# Altium project PCB_Project.PrjPcb
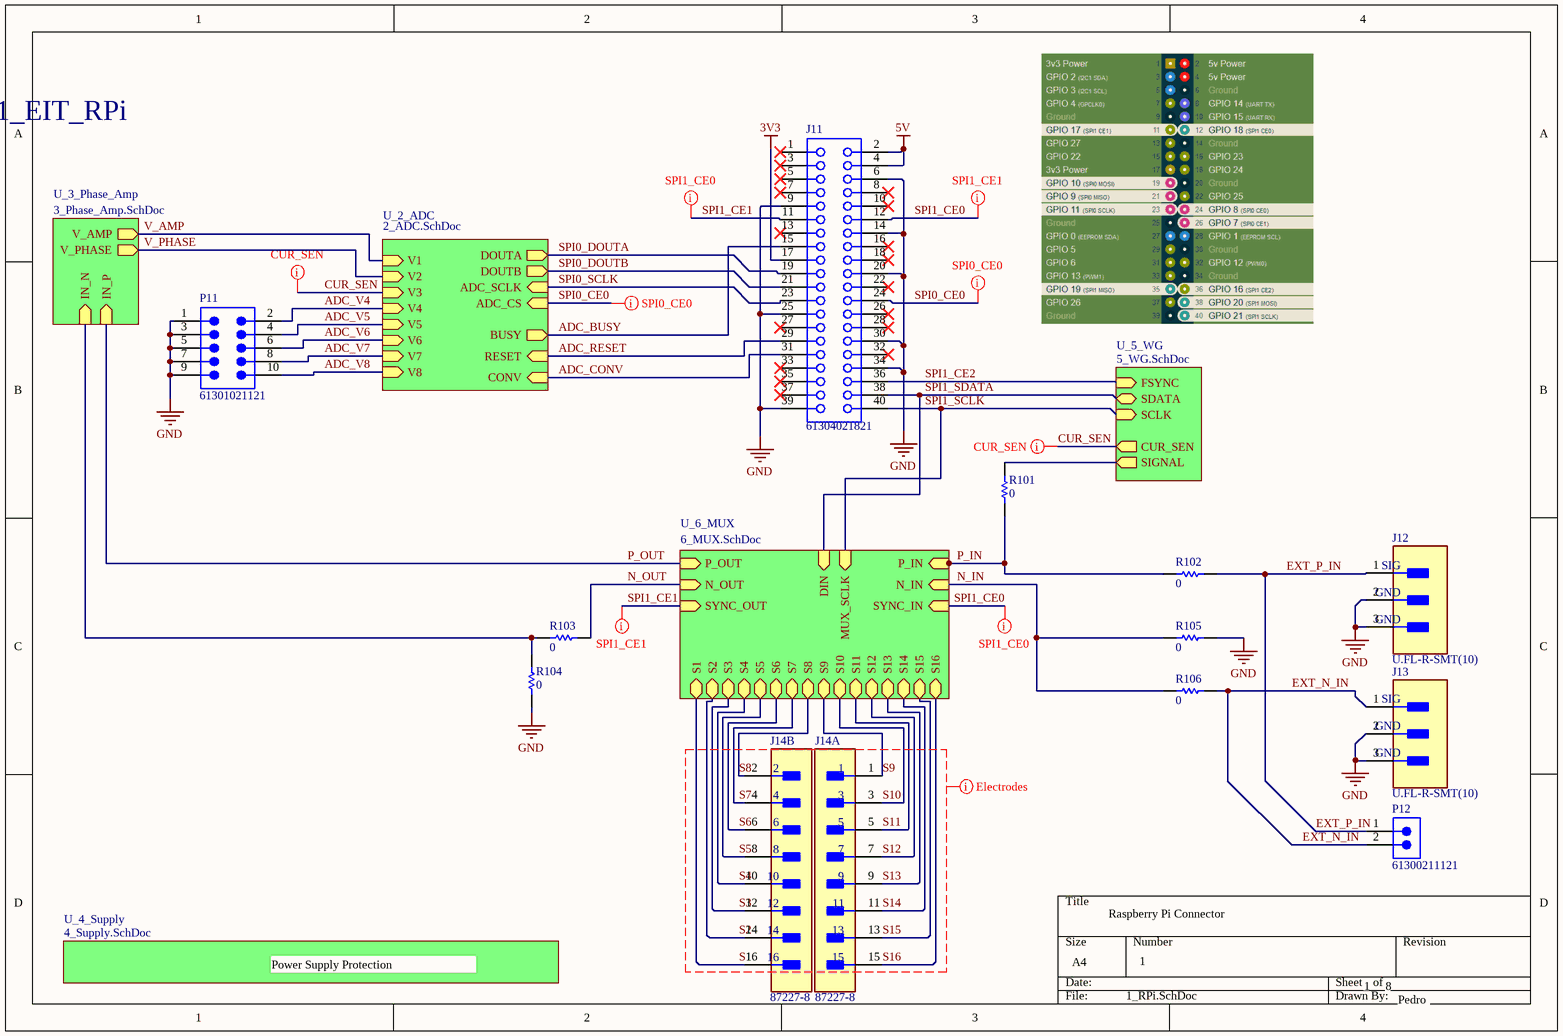
[diagram p0: 1_RPi.SchDoc]
4 sheets, 76 parts. Net scope: hierarchical (ports join the sheet entries above them; power ports are global).
Board file: 2_RPi.PcbDoc
Sheets:
  1_RPi.SchDoc
    U_2_ADC = 2_ADC.SchDoc
    U_3_Phase_Amp = 3_Phase_Amp.SchDoc
    U_5_WG = 5_WG.SchDoc

## Sheet 1_RPi.SchDoc
size A4; DocumentNumber: 1; SheetNumber: 1; SheetTotal: 8

### Parts
J11  61304021821  [61304021821]
J12  U.FL-R-SMT(10)  [FP-U_FL-R-SMT_10-MFG]
J13  U.FL-R-SMT(10)  [FP-U_FL-R-SMT_10-MFG]
J14  87227-8  [FP-87227-8-MFG]  (parts A,B of 2)
P11  61301021121  [61301021121]
P12  61300211121  [61300211121]
R101  Resistance: 0  [RESC1608X55X25LL10T15]  (hidden comment: RC0603JR-070RL)
R102  Resistance: 0  [RESC1608X55X25LL10T15]  (hidden comment: RC0603JR-070RL)
R103  Resistance: 0  [RESC1608X55X25LL10T15]  (hidden comment: RC0603JR-070RL)
R104  Resistance: 0  [RESC1608X55X25LL10T15]  (hidden comment: RC0603JR-070RL)
R105  Resistance: 0  [RESC1608X55X25LL10T15]  (hidden comment: RC0603JR-070RL)
R106  Resistance: 0  [RESC1608X55X25LL10T15]  (hidden comment: RC0603JR-070RL)

### Sub-sheets
U_2_ADC = 2_ADC.SchDoc: RESET (in), CONV (in), BUSY (out), ADC_SCLK (in), ADC_CS (in), DOUTA (out), DOUTB (out), V1 (in), V2 (in), V3 (in), V4 (in), V5 (in), V6 (in), V7 (in), V8 (in)
U_3_Phase_Amp = 3_Phase_Amp.SchDoc: V_PHASE (out), V_AMP (out), IN_P (in), IN_N (in)
U_4_Supply = 4_Supply.SchDoc (file not in this document): no entries
U_5_WG = 5_WG.SchDoc: FSYNC (in), SCLK (in), SDATA (bidir), SIGNAL (out), CUR_SEN (out)
U_6_MUX = 6_MUX.SchDoc (file not in this document): P_IN (in), SYNC_IN (in), N_IN (in), S1 (bidir), SYNC_OUT (in), MUX_SCLK (in), DIN (in), S2 (bidir), S3 (bidir), S4 (bidir), S5 (bidir), S6 (bidir), S7 (bidir), S8 (bidir), S9 (bidir), S10 (bidir), S11 (bidir), S12 (bidir), S13 (bidir), S14 (bidir), S15 (bidir), S16 (bidir), P_OUT (in), N_OUT (in)

### Nets
3V3: J11.17
5V: J11.2 J11.4
GND: J11.6 J11.9 J11.14 J11.20 J11.25 J11.30 J11.34 J11.39 J12.2(GND) J12.3(GND) J13.2(GND) J13.3(GND) P11.1 P11.3 P11.5 P11.7 P11.9 R104.2 R105.1
ADC_BUSY: J11.15 ; sheet U_2_ADC/BUSY
ADC_CONV: J11.31 ; sheet U_2_ADC/CONV
ADC_RESET: J11.29 ; sheet U_2_ADC/RESET
ADC_V4: P11.2 ; sheet U_2_ADC/V4
ADC_V5: P11.4 ; sheet U_2_ADC/V5
ADC_V6: P11.6 ; sheet U_2_ADC/V6
ADC_V7: P11.8 ; sheet U_2_ADC/V7
ADC_V8: P11.10 ; sheet U_2_ADC/V8
CUR_SEN: sheet U_2_ADC/V3, sheet U_5_WG/CUR_SEN
EXT_N_IN: J13.1(SIG) P12.2 R106.1
EXT_P_IN: J12.1(SIG) P12.1 R102.1
N_IN: R105.2 R106.2 ; sheet U_6_MUX/N_IN
N_OUT: R103.1 ; sheet U_6_MUX/N_OUT
P_IN: R101.2 R102.2 ; sheet U_6_MUX/P_IN
P_OUT: sheet U_3_Phase_Amp/IN_P, sheet U_6_MUX/P_OUT
S1: J14.16 ; sheet U_6_MUX/S1
S2: J14.14 ; sheet U_6_MUX/S2
S3: J14.12 ; sheet U_6_MUX/S3
S4: J14.10 ; sheet U_6_MUX/S4
S5: J14.8 ; sheet U_6_MUX/S5
S6: J14.6 ; sheet U_6_MUX/S6
S7: J14.4 ; sheet U_6_MUX/S7
S8: J14.2 ; sheet U_6_MUX/S8
S9: J14.1 ; sheet U_6_MUX/S9
S10: J14.3 ; sheet U_6_MUX/S10
S11: J14.5 ; sheet U_6_MUX/S11
S12: J14.7 ; sheet U_6_MUX/S12
S13: J14.9 ; sheet U_6_MUX/S13
S14: J14.11 ; sheet U_6_MUX/S14
S15: J14.13 ; sheet U_6_MUX/S15
S16: J14.15 ; sheet U_6_MUX/S16
SPI0_CE0: J11.24 ; sheet U_2_ADC/ADC_CS  [project net ADC_CS]
SPI0_DOUTA: J11.19 ; sheet U_2_ADC/DOUTA  [project net DOUTA]
SPI0_DOUTB: J11.21 ; sheet U_2_ADC/DOUTB  [project net DOUTB]
SPI0_SCLK: J11.23 ; sheet U_2_ADC/ADC_SCLK  [project net ADC_SCLK]
SPI1_CE0: J11.12 ; sheet U_6_MUX/SYNC_IN
SPI1_CE1: J11.11 ; sheet U_6_MUX/SYNC_OUT
SPI1_CE2: J11.36 ; sheet U_5_WG/FSYNC  [project net FSYNC]
SPI1_SCLK: J11.40 ; sheet U_5_WG/SCLK, sheet U_6_MUX/MUX_SCLK  [project net SCLK]
SPI1_SDATA: J11.38 ; sheet U_5_WG/SDATA, sheet U_6_MUX/DIN  [project net SDATA]
V_AMP: sheet U_2_ADC/V1, sheet U_3_Phase_Amp/V_AMP  [project net V1]
V_PHASE: sheet U_2_ADC/V2, sheet U_3_Phase_Amp/V_PHASE  [project net V2]
NetC310_2: R103.2 R104.1 ; sheet U_3_Phase_Amp/IN_N
NetIC52_5: R101.1 ; sheet U_5_WG/SIGNAL

Not connected (* = marked no-connect by the designer): J11 1* 3* 5* 7* 8* 10* 13* 16* 18* 22* 26* 27* 28* 32* 33* 35* 37*

### Layout directives
mark named SPI0_CE0: ADC_CS
mark named SPI1_CE1: SPI1_CE0, SPI1_CE1
mark named SPI1_CE0: SPI1_CE0, SPI1_CE1
mark named CUR_SEN: CUR_SEN
net class Electrodes: S1, S2, S3, S4, S5, S6, S7, S8, S9, S10, S11, S12, S13, S14, S15, S16

### Notes on the sheet
- [1] - 1_EIT_RPi
- Raspberry Pi Connector
- Power Supply Protection
- 1
- 8
- Pedro

### Library data of the parts
J11 = CMP-1502-01370-3: NexarPartId: 61924769; Gender: Female; Contact Resistance: 20mΩ; Current Rating: 3A; Operating Supply Voltage: 250V; Orientation: Vertical; Lead Pitch: 2.54mm; Number of Pins: 40; RoHS: Non-Compliant
J12 J13 = eef6fde44c591823e8076210edfe12f: CONN U.FL RCPT STR 50 OHM SMD; Plating: Silver; Connector Type: Coaxial; Frequency: 6GHz; Impedance: 50R; Body Material: Bronze; Dielectric Material: Polymer; Contact Plating: Gold; Termination: Solder; Orientation: Vertical; Contact Material: Brass; Min Operating Temperature: -40°C; Mount: Surface Mount; Lead Free: Lead Free; Max Operating Temperature: 90°C; Radiation Hardening: No; Packaging: Tape and Reel; Body Plating: Silver; Fastening Type: Snap; Max Frequency: 6GHz; Depth: 3.1mm; Package Quantity: 1; Case/Package: SMD/SMT; Housing Color: Beige; Length: 3mm
J14 = CMP-03369-000064-1: CONN HEADER VERT 16POS 2.54MM; Manufacturer: TE Connectivity; Conn Gender: Male; Conn Orientation: Straight; Current Rating: 3A; Number Of Contacts: 16; Mouser Description: Headers & Wire Housings UNSHRD VERT DUAL 16; Lead Free: Yes; Digikey Description: CONN HEADER VERT 16POS 2.54MM; Device Class L3: unset; Automotive: No; Height: 0.428inch; Temperature Range Low: -65°C; Device Class L1: Connectors; RoHS: TRUE; Pitch: 2.54mm; Package: 0; Manufacturer Part Number: 87227-8; Number Of Rows: 2; Footprint Url: https://www.te.com/commerce/DocumentDelivery/DDEController?Action=showdoc&DocId=Customer+Drawing%7F87227%7FH4%7Fpdf%7FEnglish%7FENG_CD_87227_H4.pdf%7F87227-8; ComponentLink2URL: https://www.te.com/usa-en/product-87227-8.datasheet.pdf; ComponentLink2Description: Datasheet; Temperature: -65°C to +105°C; Category: Conn; Temperature Range High: +105°C; Octopart: https://octopart.com/87227-8-te+connectivity-39407754; Device Class L2: Headers and Wire Housings; Contact Material: Gold,Nickel
P11 = Header_Male_2R_10P: NexarPartId: 18818163; Connector Type: Male Pin; Insulation Resistance: 1GΩ; Row Spacing: 2.54mm; Insulation: Insulated; Number of Positions: 10; Current Rating: 3A; Voltage Rating: 250V; Gender: Male; Contact Resistance: 20mΩ; Contact Gender: Male; Number of Rows: 2; Min Operating Temperature: -40°C; Mount: Through Hole; Packaging: Bulk; Length: 12.7mm; Pitch: 2.54mm; RoHS: Compliant; Height: 2.54mm; Lead Pitch: 2.54mm; Number of Pins: 10; Housing Material: PBT; Orientation: Vertical; Flammability Rating: UL94 V-0; Termination: Through Hole; Width: 12.7mm; Color: Black; Contact Mating Length: 5.9944mm; Max Operating Temperature: 105°C; Operating Supply Voltage: 250V; Contact Material: Copper; Number of Contacts: 10; Contact Plating: Gold; REACH SVHC: Unknown
P12 = CMP-1712-00002-6: NexarPartId: 20081794; Number of Contacts: 2; Pitch: 2.54mm; Connector Type: Male Pin; Voltage Rating: 250V; Current Rating: 3A; Gender: Male; Contact Resistance: 20mΩ; Height: 8.94mm; Lead Free: Lead Free; Number of Pins: 2; Termination: Through Hole; RoHS: Compliant; Lead Pitch: 2.54mm; REACH SVHC: No SVHC; Housing Material: PBT; Contact Mating Length: 5.9944mm; Min Operating Temperature: -40°C; Orientation: Vertical; Contact Material: Copper; Contact Gender: Male; Max Operating Temperature: 125°C; Number of Rows: 1; Number of Positions: 2; Packaging: Bulk; Contact Plating: Gold; Mount: Through Hole; Color: Black; Operating Supply Voltage: 250V
R101-R106 = RES-2: Chip Resistor, 0 Ohm, +/- 5%, 0.1 W, -55 to 155 degC, 0603 (1608 Metric), RoHS, Tape and Reel; Manufacturer: Yageo; Temperature Coefficient: 200ppm/degreesC; Voltage Rating: 50V; Power Rating: 100mW; Width: 0.8mm; Max Operating Temperature: 155degC; Tolerance: 5%; Package Reference: 0603; Height: 0.45mm; Depth: 0.8mm; Package Description: 2-Pin Surface Mount Device, Body 1.6 x 0.8 mm; Termination: SMD/SMT; Package Quantity: 5000; Case/Package: 0603; Case Code (Imperial): 0603; Radiation Hardening: No; Number of Pins: 2; Length: 1.6mm; Lead Free: LeadFree; Voltage Rating (DC): 50V; Military Standard: Not; Datasheet URL: http://www.yageo.com/NewPortal/yageodocoutput?fileName=/pdf/R-Chip/PYu-RC_Group_51_RoHS_L_5.pdf; Manufacturer URL: http://www.yageo.com/; Packaging: TapeandReel; Case Code (Metric): 1608; Min Operating Temperature: -55degC; Composition: ThickFilm; RoHSCompliant: true; Contact Plating: Tin; Datasheet Version: Rev. 5, 10/2016; REACH SVHC: NoSVHC

## Sheet 2_ADC.SchDoc
size A4; SheetNumber: 2; SheetTotal: 8
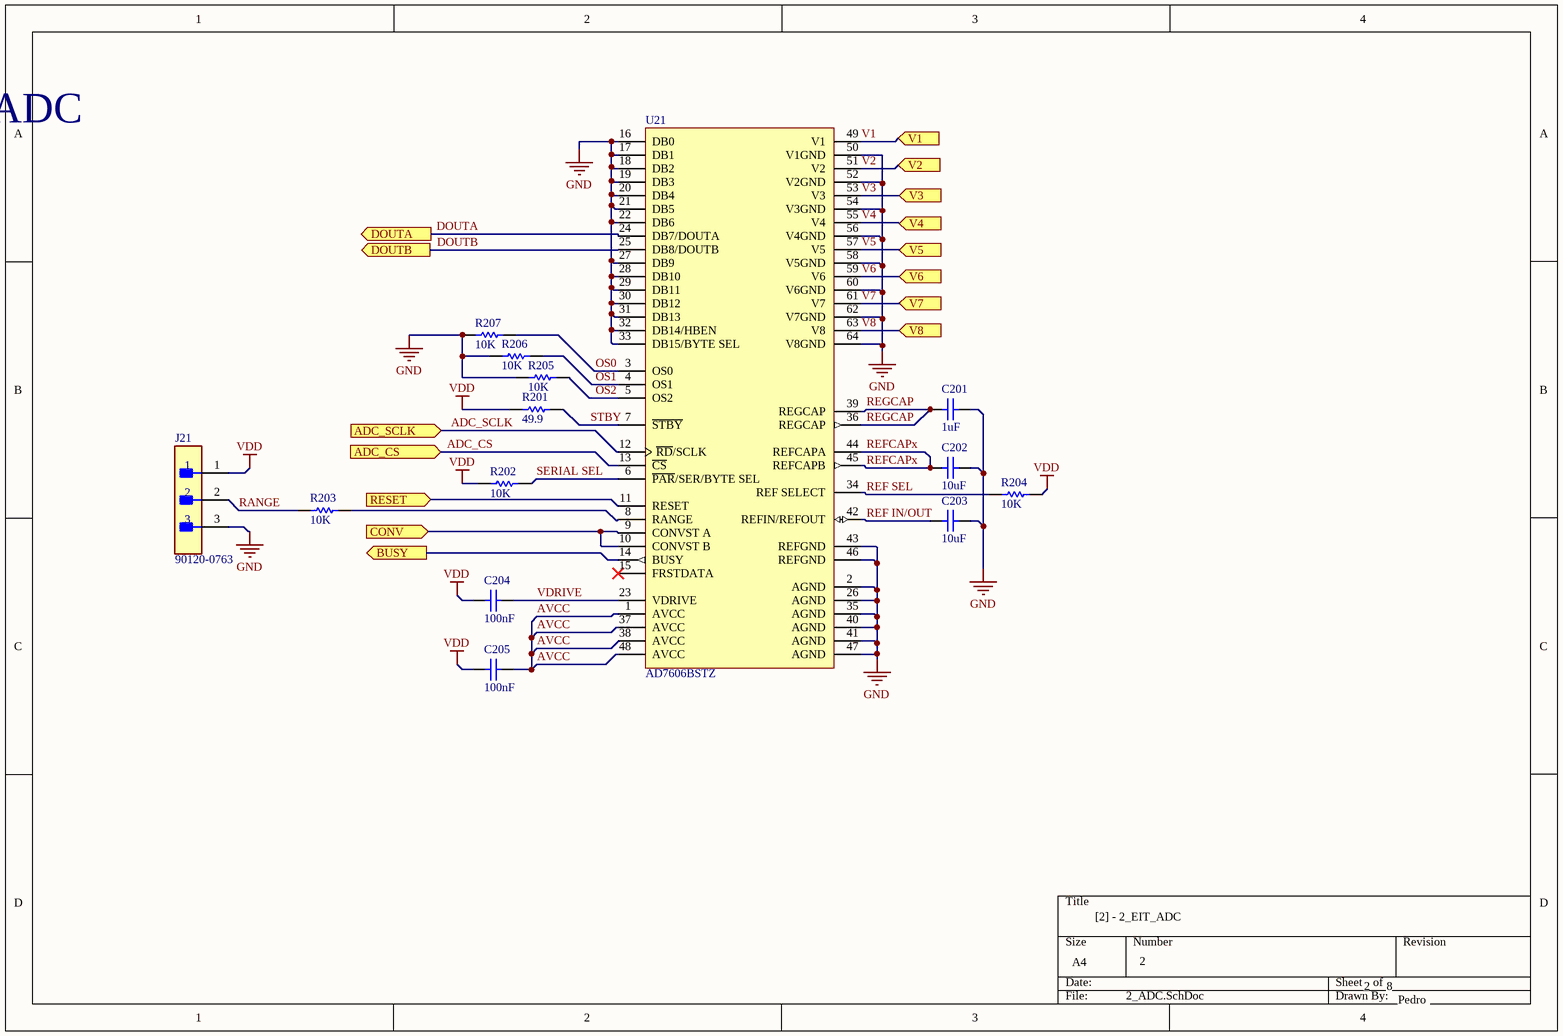
[diagram p1: 2_ADC.SchDoc]

### Parts
C201  value 1uF  [CAPC1005X55X30LL05T10]  (hidden comment: generic)
C202  value 10uF  [CAPC1005X55X30LL05T10]  (hidden comment: generic)
C203  value 10uF  [CAPC1005X55X30LL05T10]  (hidden comment: generic)
C204  value 100nF  [CAPC1005X55X30LL05T10]  (hidden comment: generic)
C205  value 100nF  [CAPC1005X55X30LL05T10]  (hidden comment: generic)
J21  90120-0763  [FP-90120-0763-MFG]
R201  Resistance: 49.9  [RESC1608X55X25LL10T15]  (hidden comment: RC0603JR-070RL)
R202  Resistance: 10K  [RESC1608X55X25LL10T15]  (hidden comment: RC0603JR-070RL)
R203  Resistance: 10K  [RESC1608X55X25LL10T15]  (hidden comment: RC0603JR-070RL)
R204  Resistance: 10K  [RESC1608X55X25LL10T15]  (hidden comment: RC0603JR-070RL)
R205  Resistance: 10K  [RESC1608X55X25LL10T15]  (hidden comment: RC0603JR-070RL)
R206  Resistance: 10K  [RESC1608X55X25LL10T15]  (hidden comment: RC0603JR-070RL)
R207  Resistance: 10K  [RESC1608X55X25LL10T15]  (hidden comment: RC0603JR-070RL)
U21  AD7606BSTZ  [ST-64-2_L]

### Ports
ADC_CS (in, see 1_RPi[2B]), ADC_SCLK (in, see 1_RPi[2B]), BUSY (out, see 1_RPi[2B]), CONV (in, see 1_RPi[2B]), DOUTA (out, see 1_RPi[2A]), DOUTB (out, see 1_RPi[2B]), RESET (in, see 1_RPi[2B]), V1 (in, see 1_RPi[1A]), V2 (in, see 1_RPi[1B]), V3 (in, see 1_RPi[1B]), V4 (in, see 1_RPi[1B]), V5 (in, see 1_RPi[1B]), V6 (in, see 1_RPi[1B]), V7 (in, see 1_RPi[1B]), V8 (in, see 1_RPi[1B])

### Nets
GND: C201.1 C202.1 C203.1 J21.3 R205.2 R206.2 R207.2 U21.2(AGND) U21.16(DB0) U21.17(DB1) U21.18(DB2) U21.19(DB3) U21.20(DB4) U21.21(DB5) U21.22(DB6) U21.26(AGND) U21.27(DB9) U21.28(DB10) U21.29(DB11) U21.30(DB12) U21.31(DB13) U21.32(DB14/HBEN) U21.33(DB15/BYTE_SEL) U21.35(AGND) U21.40(AGND) U21.41(AGND) U21.43(REFGND) U21.46(REFGND) U21.47(AGND) U21.50(V1GND) U21.52(V2GND) U21.54(V3GND) U21.56(V4GND) U21.58(V5GND) U21.60(V6GND) U21.62(V7GND) U21.64(V8GND)
VDD: C204.2 C205.2 J21.1 R201.2 R202.2 R204.1
ADC_BUSY: U21.14(BUSY) ; port BUSY
ADC_CONV: U21.9(CONVST_A) U21.10(CONVST_B) ; port CONV
ADC_CS: U21.13(~{CS}) ; port ADC_CS
ADC_RESET: U21.11(RESET) ; port RESET
ADC_SCLK: U21.12(~{RD}/SCLK) ; port ADC_SCLK
AVCC: C205.1 U21.1(AVCC) U21.37(AVCC) U21.38(AVCC) U21.48(AVCC)
DOUTA: U21.24(DB7/DOUTA) ; port DOUTA
DOUTB: U21.25(DB8/DOUTB) ; port DOUTB
OS0: R207.1 U21.3(OS0)
OS1: R206.1 U21.4(OS1)
OS2: R205.1 U21.5(OS2)
RANGE: J21.2 R203.2
REF IN/OUT: C203.2 U21.42(REFIN/REFOUT)
REF SEL: R204.2 U21.34(REF_SELECT)
REFCAPx: C202.2 U21.44(REFCAPA) U21.45(REFCAPB)
REGCAP: C201.2 U21.36(REGCAP) U21.39(REGCAP)
SERIAL SEL: R202.1 U21.6(~{PAR}/SER/BYTE_SEL)
STBY: R201.1 U21.7(~{STBY})
V1: U21.49(V1) ; port V1
V2: U21.51(V2) ; port V2
V3: U21.53(V3) ; port V3  [project net CUR_SEN]
V4: U21.55(V4) ; port V4  [project net ADC_V4]
V5: U21.57(V5) ; port V5  [project net ADC_V5]
V6: U21.59(V6) ; port V6  [project net ADC_V6]
V7: U21.61(V7) ; port V7  [project net ADC_V7]
V8: U21.63(V8) ; port V8  [project net ADC_V8]
VDRIVE: C204.1 U21.23(VDRIVE)
NetR203_1: R203.1 U21.8(RANGE)

Not connected (* = marked no-connect by the designer): U21 15(FRSTDATA)*

### Notes on the sheet
- [2] - 2_EIT_ADC
- 2
- 8
- Pedro

### Library data of the parts
C201-C205 = Capacitor: Device Class L1: Passive Components; Device Class L2: Capacitors
J21 = CMP-04776-000084-1: CONN HEADER VERT 3POS 2.54MM; Manufacturer: Molex; Voltage Rating: 350V; Number Of Contacts: 3; Conn Orientation: Vertical; Current Rating: 3A; Conn Gender: Male; Package: 90120-0763; ComponentLink2Description: Datasheet; Height: 5.8mm; Manufacturer Part Number: 90120-0763; Temperature Range High: +125°C; RoHS: TRUE; ComponentLink2URL: https://www.molex.com/webdocs/datasheets/pdf/en-us/0901200763_PCB_HEADERS.pdf; Device Class L2: Headers and Wire Housings; Temperature: -55°C to +125°C; Device Class L1: Connectors; Pitch: 2.54mm; Footprint Url: https://www.molex.com/pdm_docs/sd/901200763_sd.pdf; Device Class L3: unset; Temperature Range Low: -55°C; Number Of Rows: 1; Category: Conn; Lead Free: Yes; Mouser Description: Board-To-Board Connector, C-Grid III 90120 Series, Through Hole, Header, 3, 2.54 mm; Octopart: https://octopart.com/90120-0763-molex-655433; Contact Material: Gold,Nickel; Automotive: No; Digikey Description: CONN HEADER VERT 3POS 2.54MM
R201-R207 = RES-2: as R101 on sheet 1_RPi; Width: 0.8mm; Max Operating Temperature: 155degC; Tolerance: 5%; Package Reference: 0603; Height: 0.45mm; Depth: 0.8mm; Package Description: 2-Pin Surface Mount Device, Body 1.6 x 0.8 mm; Termination: SMD/SMT; Package Quantity: 5000; Case/Package: 0603; Case Code (Imperial): 0603; Radiation Hardening: No; Number of Pins: 2; Length: 1.6mm; Lead Free: LeadFree; Voltage Rating (DC): 50V; Military Standard: Not; Datasheet URL: http://www.yageo.com/NewPortal/yageodocoutput?fileName=/pdf/R-Chip/PYu-RC_Group_51_RoHS_L_5.pdf; Manufacturer URL: http://www.yageo.com/; Packaging: TapeandReel; Case Code (Metric): 1608; Min Operating Temperature: -55degC; Composition: ThickFilm; RoHSCompliant: true; Contact Plating: Tin; Datasheet Version: Rev. 5, 10/2016; REACH SVHC: NoSVHC
U21 = CMP-0313-00724-2: 8 Channel Data Acquisition System with 16-Bit, Bipolar Input, Simultaneous Sampling Analog-to-Digital Converter with Parallel, Serial and SPI Interface, 200KSPS, -40 to +85 degC, ST-64-2, Pb-Free, Tray; Generic Part Number: AD7606; Manufacturer: Analog Devices; Throughput Rate (SPS): 200K; Resolution (Bits): 16; Channels: 8; Interface: Par, Ser, SPI; ComponentLink2Description: Datasheet; ComponentLink1URL: http://www.analog.com/en/index.html; ComponentLink4URL: http://www.analog.com/en/analog-to-digital-converters/ad-converters/ad7606/products/product.html; DatasheetVersion: Rev.C; RoHS: Y; Code_JEDEC: MS-026-BCD; PartNumber: AD7606BSTZ; PackageVersion: 051706-A; Mounting Technology: Surface Mount; ComponentLink3URL: http://www.analog.com/static/imported-files/packages/PKG_PDF/LQFP%28ST%29/ST_64_2.pdf; PackageDescription: 64-Lead Low Profile Quad Flat Package [LQFP]; Packing: Tray; PackageReference: ST-64-2; ComponentLink1Description: Manufacturer URL; ComponentLink4Description: Product URL; ComponentLink2URL: http://www.analog.com/static/imported-files/data_sheets/AD7606_7606-6_7606-4.pdf; ComponentLink3Description: Package Specification; Supplier: Mouser; Supplier Part Number: 584-AD7606BSTZ; Manufacturer Part Number: AD7606BSTZ; Category: Analog to Digital Converters (ADCs); Stock: 2011; Pricing: 1=39,63, 10=37, 50=32,25, 100=31,46, 1000=31,46, 10000=31,46 (USD); ComponentLink5URL: https://datasheet.ciiva.com/1143/1595896-1143555.pdf?src-supplier=Element14; ComponentLink5Description: https://datasheet.ciiva.com/1143/1595896-1143555.pdf?src-supplier=Element14; ComponentLink6URL: https://datasheet.ciiva.com/3037/ad7606-7606-6-7606-4-3037717.pdf?src-supplier=Avnet; ComponentLink6Description: https://datasheet.ciiva.com/3037/ad7606-7606-6-7606-4-3037717.pdf?src-supplier=Avnet

## Sheet 3_Phase_Amp.SchDoc
size A4; DocumentNumber: 2; SheetNumber: 3; SheetTotal: 8
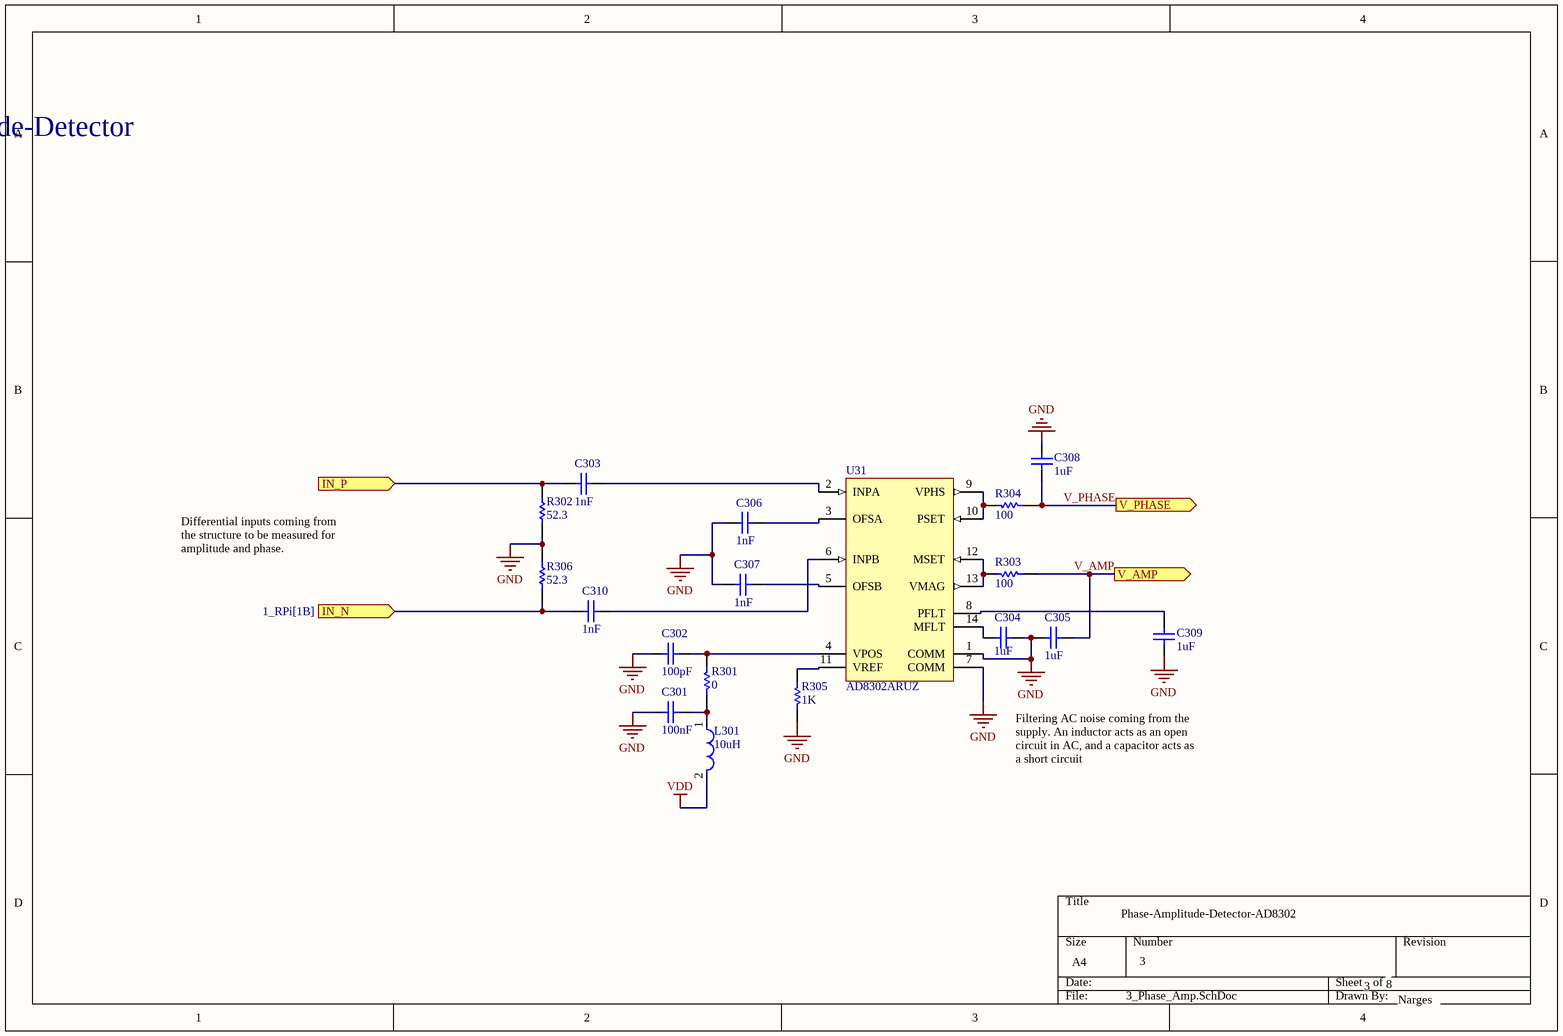
[diagram p2: 3_Phase_Amp.SchDoc]

### Parts
C301  value 100nF  [CAPC1005X55X30LL05T10]  (hidden comment: generic)
C302  value 100pF  [CAPC1005X55X30LL05T10]  (hidden comment: generic)
C303  value 1nF  [CAPC1005X55X30LL05T10]  (hidden comment: generic)
C304  value 1uF  [CAPC1005X55X30LL05T10]  (hidden comment: generic)
C305  value 1uF  [CAPC1005X55X30LL05T10]  (hidden comment: generic)
C306  value 1nF  [CAPC1005X55X30LL05T10]  (hidden comment: generic)
C307  value 1nF  [CAPC1005X55X30LL05T10]  (hidden comment: generic)
C308  value 1uF  [CAPC1005X55X30LL05T10]  (hidden comment: generic)
C309  value 1uF  [CAPC1005X55X30LL05T10]  (hidden comment: generic)
C310  value 1nF  [CAPC1005X55X30LL05T10]  (hidden comment: generic)
L301  Inductance: 10uH  [IND_0402HL-821XJRU]  (hidden comment: LQW18AN10NG00D)
R301  0  [RESC1005X40X25LL10T10]
R302  52.3  [RESC1005X40X25LL10T10]
R303  100  [RESC1005X40X25LL10T10]
R304  100  [RESC1005X40X25LL10T10]
R305  1K  [RESC1005X40X25LL10T10]
R306  52.3  [RESC1005X40X25LL10T10]
U31  AD8302ARUZ  [ADI-RU-14_L]

### Ports
IN_N (in, see 1_RPi[1B]), IN_P (in, see 1_RPi[1B]), V_AMP (out, see 1_RPi[1A]), V_PHASE (out, see 1_RPi[1A])

### Nets
GND: C301.1 C302.1 C304.1 C305.1 C306.2 C307.2 C308.1 C309.1 R302.1 R305.1 R306.2 U31.1(COMM) U31.7(COMM)
VDD: L301.2
P_OUT: C303.1 R302.2 ; port IN_P
V_AMP: C305.2 R303.2 ; port V_AMP  [project net V1]
V_PHASE: C308.2 R304.2 ; port V_PHASE  [project net V2]
NetC301_2: C301.2 L301.1 R301.2
NetC302_2: C302.2 R301.1 U31.4(VPOS)
NetC303_2: C303.2 U31.2(INPA)
NetC304_2: C304.2 U31.14(MFLT)
NetC306_1: C306.1 U31.3(OFSA)
NetC307_1: C307.1 U31.5(OFSB)
NetC309_2: C309.2 U31.8(PFLT)
NetC310_1: C310.1 U31.6(INPB)
NetC310_2: C310.2 R306.1 ; port IN_N
NetR303_1: R303.1 U31.12(MSET) U31.13(VMAG)
NetR304_1: R304.1 U31.9(VPHS) U31.10(PSET)
NetR305_2: R305.2 U31.11(VREF)

### Notes on the sheet
- [3] - 3_EIT_Phase-Amplitude-Detector
- Differential inputs coming from the structure to be measured for amplitude and phase.
- Filtering AC noise coming from the supply. An inductor acts as an open circuit in AC, and a capacitor acts as a short circuit
- Phase-Amplitude-Detector-AD8302
- 3
- 8
- Narges

### Library data of the parts
C301-C310 = Capacitor: Device Class L1: Passive Components; Device Class L2: Capacitors
L301 = 725321dda6339637d4d059423bc1c3c: Wire Wound RF Inductor 10nH ±2% 650mA 0.11Ω 0603 (1608); DC Resistance (DCR): 110mR; Q Factor: 35; Shielding: Unshielded; Test Frequency: 100MHz; Current: 550mA; Self Resonant Frequency: 6GHz; Radiation Hardening: No; Depth: 1mm; Case Code (Imperial): 0603; Inductance Tolerance: 2%; Series: LQW18A_00; Tolerance: 2%; Weight: 0.000106oz; Rated Current-Max: 650mA; Mount: Surface Mount; Series Resistance: 110mR; REACH SVHC: No SVHC; Current Rating: 650mA; Case Code (Metric): 1608; Lead Free: Lead Free; Resistor Type: Wirewound; Package Quantity: 4000; Termination: SMD/SMT; DC Current: 650mA; Height: 0.8mm; Min Operating Temperature: -55°C; Military Standard: Not; Max Operating Temperature: 125°C; Max DC Current: 650mA; Case/Package: 0603; Number of Pins: 2; Packaging: Tape and Reel; Width: 0.8mm; Length: 1.6mm
R301-R306 = Resistor: generic; Part Number: RC0402FR-0747KL; Manufacturer: Yageo / Phycomp
U31 = CMP-0284-00076-1: LF-2.7 GHz RF/IF Gain and Phase Detector, 60ns Response Time, RU-14, Pb-Free, 96 Tube; Voltage Supply (V): 2.7 to 5.5; RF Frequency (MHz): 2700; Dynamic Range (dB): 60dB; Supply Current: 19mA; Temp Stability (dB): 1dB; Product Description: Dual-Channel Gain and Phase Outputs; ComponentLink1URL: www.analog.com; Response Time (ns typ): 60ns; ComponentLink1Description: Manufacturer URL; Code_JEDEC: MO-153AB-1; ComponentLink3URL: http://www.analog.com/static/imported-files/packages/36057385283879153717235186773RU14.pdf; PackageReference: RU-14; PackageVersion: Aug-2002; DatasheetVersion: Rev. A; ComponentLink2URL: http://www.analog.com/static/imported-files/data_sheets/AD8302.pdf; ComponentLink3Description: Package Specification; PackageDescription: 14-Lead Thin Shrink Small Outline Package [TSSOP]; ComponentLink2Description: Datasheet

## Sheet 5_WG.SchDoc
size A3; DocumentNumber: 4; SheetNumber: 5; SheetTotal: 8
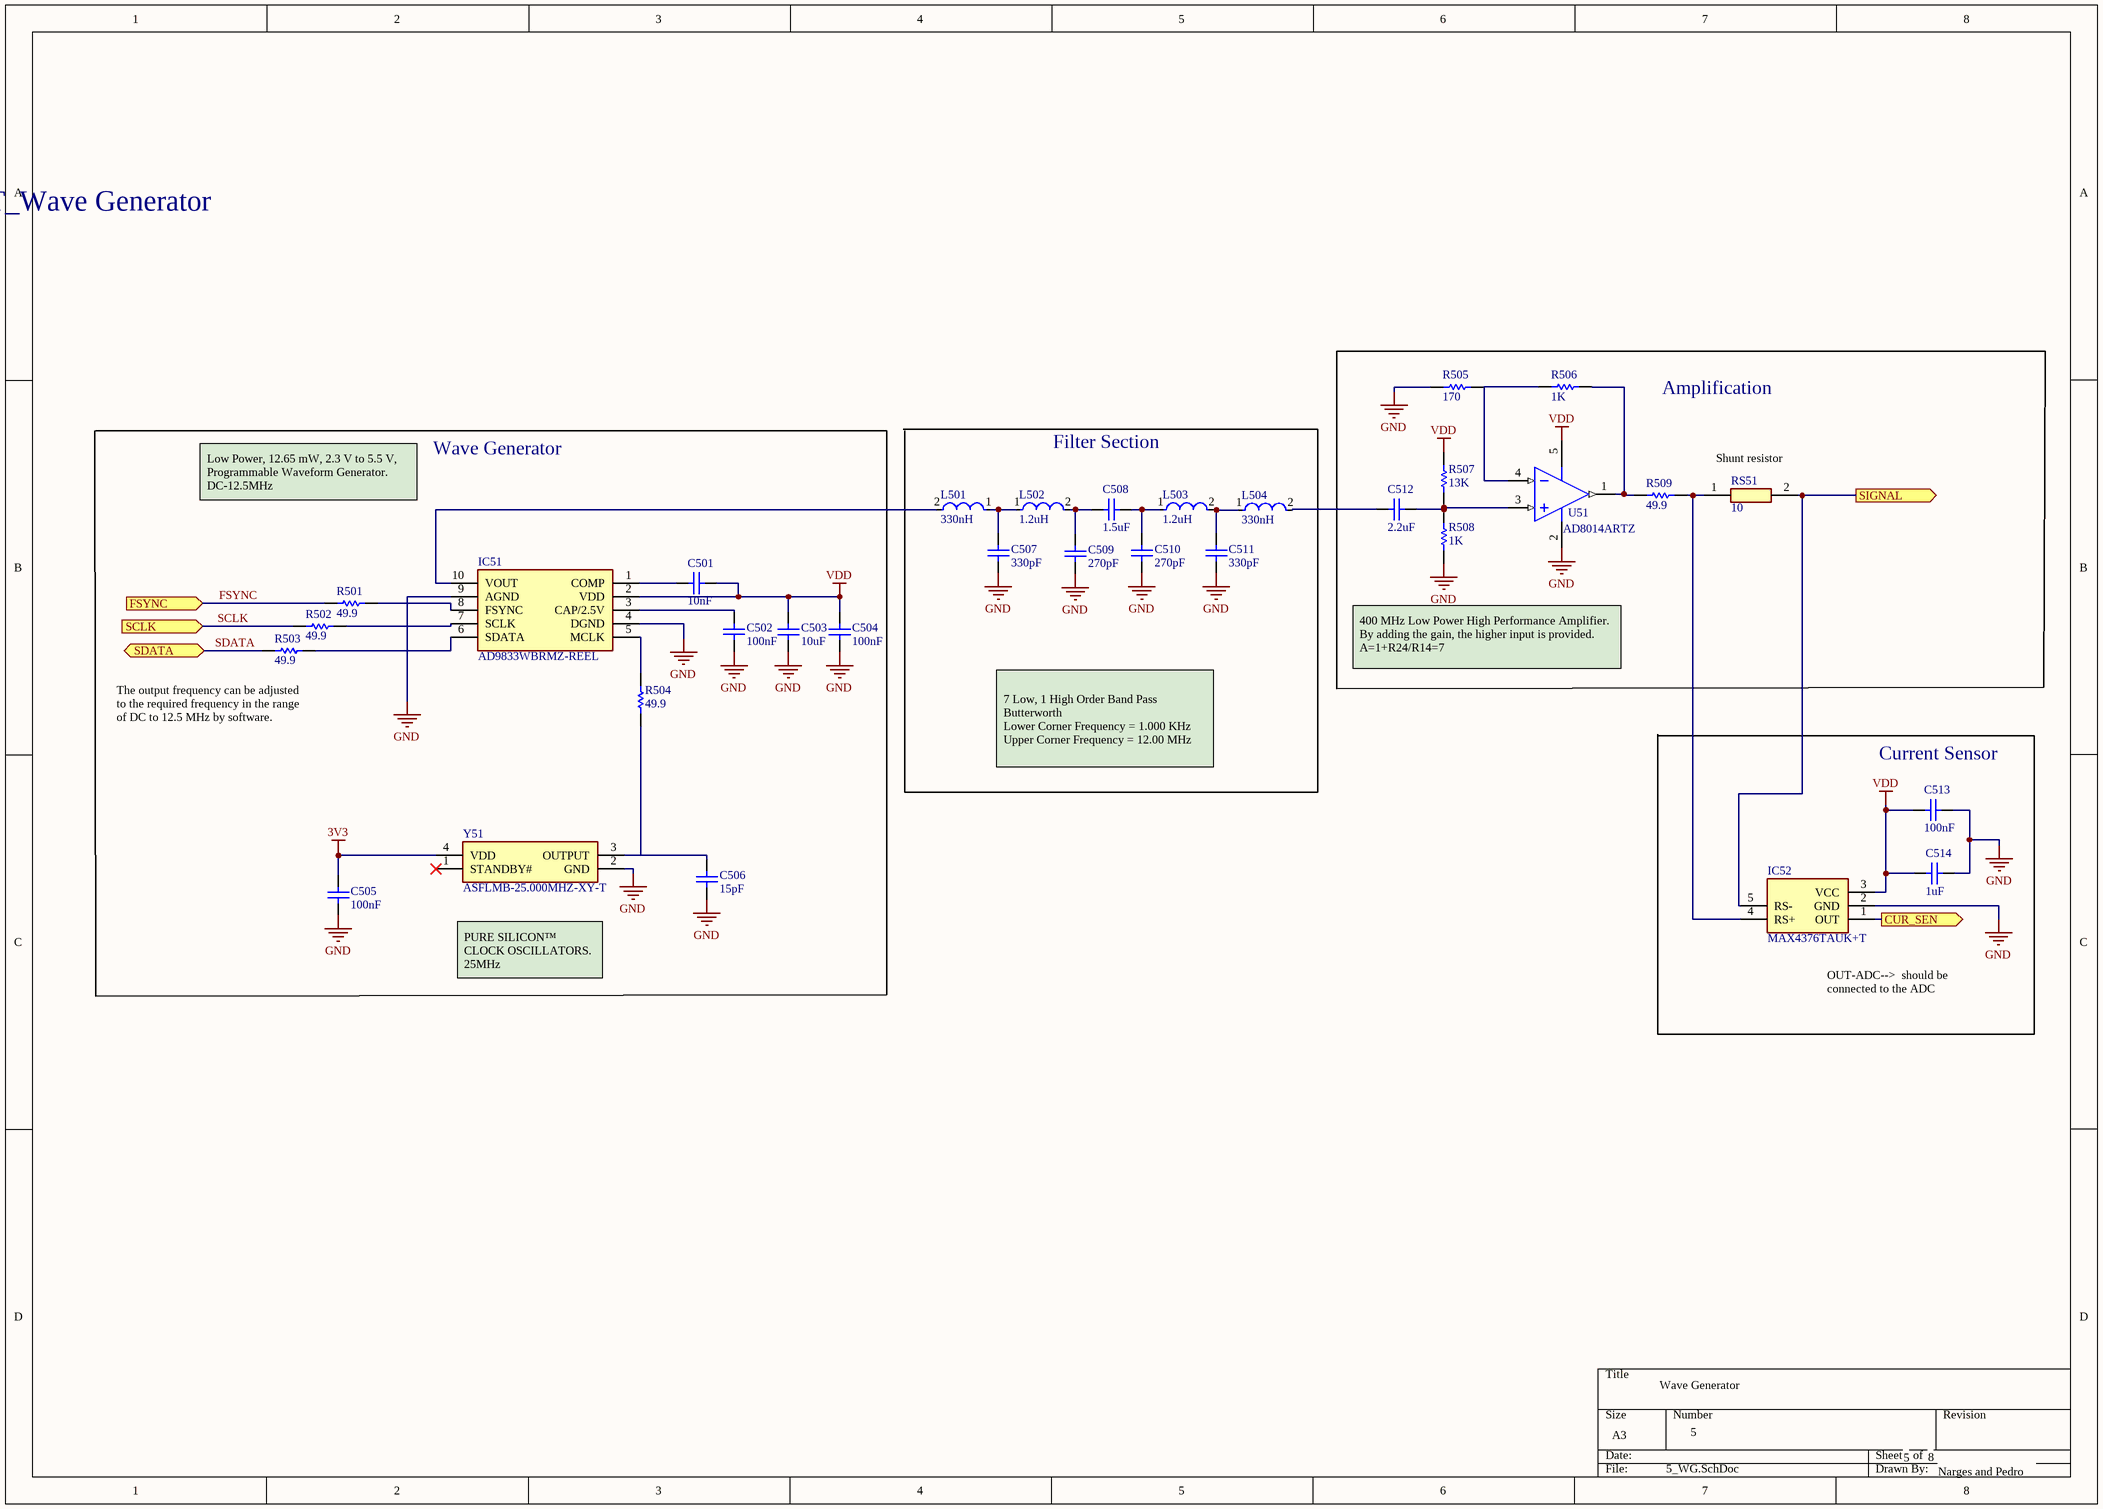
[diagram p3: 5_WG.SchDoc]

### Parts
C501  value 10nF  [CAPC1005X55X30LL05T10]  (hidden comment: generic)
C502  value 100nF  [CAPC1005X55X30LL05T10]  (hidden comment: generic)
C503  value 10uF  [CAPC1005X55X30LL05T10]  (hidden comment: generic)
C504  value 100nF  [CAPC1005X55X30LL05T10]  (hidden comment: generic)
C505  value 100nF  [CAPC1005X55X30LL05T10]  (hidden comment: generic)
C506  value 15pF  [CAPC1005X55X30LL05T10]  (hidden comment: generic)
C507  value 330pF  [CAPC1005X55X30LL05T10]  (hidden comment: generic)
C508  value 1.5uF  [CAPC1005X55X30LL05T10]  (hidden comment: generic)
C509  value 270pF  [CAPC1005X55X30LL05T10]  (hidden comment: generic)
C510  value 270pF  [CAPC1005X55X30LL05T10]  (hidden comment: generic)
C511  value 330pF  [CAPC1005X55X30LL05T10]  (hidden comment: generic)
C512  value 2.2uF  [CAPC1005X55X30LL05T10]  (hidden comment: generic)
C513  value 100nF  [CAPC1005X55X30LL05T10]  (hidden comment: generic)
C514  value 1uF  [CAPC1005X55X30LL05T10]  (hidden comment: generic)
IC51  AD9833WBRMZ-REEL  [ADI-RM-10_L]
IC52  MAX4376TAUK+T  [MAXM-U5+2_L]
L501  Inductance: 330nH  [IND_0402HL-821XJRU]  (hidden comment: LQW18AN10NG00D)
L502  Inductance: 1.2uH  [IND_0402HL-821XJRU]  (hidden comment: LQW18AN10NG00D)
L503  Inductance: 1.2uH  [IND_0402HL-821XJRU]  (hidden comment: LQW18AN10NG00D)
L504  Inductance: 330nH  [IND_0402HL-821XJRU]  (hidden comment: LQW18AN10NG00D)
R501  Resistance: 49.9  [RESC1608X55X25LL10T15]  (hidden comment: RC0603JR-070RL)
R502  Resistance: 49.9  [RESC1608X55X25LL10T15]  (hidden comment: RC0603JR-070RL)
R503  Resistance: 49.9  [RESC1608X55X25LL10T15]  (hidden comment: RC0603JR-070RL)
R504  Resistance: 49.9  [RESC1608X55X25LL10T15]  (hidden comment: RC0603JR-070RL)
R505  Resistance: 170  [RESC1608X55X25LL10T15]  (hidden comment: RC0603JR-070RL)
R506  Resistance: 1K  [RESC1608X55X25LL10T15]  (hidden comment: RC0603JR-070RL)
R507  Resistance: 13K  [RESC1608X55X25LL10T15]  (hidden comment: RC0603JR-070RL)
R508  Resistance: 1K  [RESC1608X55X25LL10T15]  (hidden comment: RC0603JR-070RL)
R509  Resistance: 49.9  [RESC1608X55X25LL10T15]  (hidden comment: RC0603JR-070RL)
RS51  10  [RESC6331X80N]
U51  AD8014ARTZ  [ADI-RJ-5_L]
Y51  ASFLMB-25.000MHZ-XY-T  [FP-ASFL3-MFG]

### Blocks framed on the sheet
Amplification: C512 R505-R509 RS51 U51
Wave Generator: C501-C506 IC51 R501-R504 Y51
Filter Section: C507-C511 L501-L504
Current Sensor: C513 C514 IC52

### Ports
CUR_SEN (out, see 1_RPi[3B]), FSYNC (in, see 1_RPi[3B]), SCLK (in, see 1_RPi[3B]), SDATA (bidir, see 1_RPi[3B]), SIGNAL (out, see 1_RPi[3B])

### Nets
3V3: C505.2 Y51.4(VDD)
GND: C502.1 C503.1 C504.1 C505.1 C506.1 C507.2 C509.2 C510.1 C511.2 C513.2 C514.2 IC51.4(DGND) IC51.9(AGND) IC52.2(GND) R505.1 R508.1 U51.2(-VS) Y51.2(GND)
VDD: C501.1 C503.2 C504.2 C513.1 C514.1 IC51.2(VDD) IC52.3(VCC) R507.2 U51.5(+VS)
CUR_SEN: IC52.1(OUT) ; port CUR_SEN
FSYNC: R501.1 ; port FSYNC
SCLK: R502.1 ; port SCLK
SDATA: R503.1 ; port SDATA
NetC501_2: C501.2 IC51.1(COMP)
NetC502_2: C502.2 IC51.3(CAP/2.5V)
NetC506_2: C506.2 R504.1 Y51.3(OUTPUT)
NetC507_1: C507.1 L501.1 L502.1
NetC508_1: C508.1 C510.2 L503.1
NetC508_2: C508.2 C509.1 L502.2
NetC511_1: C511.1 L503.2 L504.1
NetC512_1: C512.1 R507.1 R508.2 U51.3(+IN)
NetC512_2: C512.2 L504.2
NetIC51_5: IC51.5(MCLK) R504.2
NetIC51_6: IC51.6(SDATA) R503.2
NetIC51_7: IC51.7(SCLK) R502.2
NetIC51_8: IC51.8(FSYNC) R501.2
NetIC51_10: IC51.10(VOUT) L501.2
NetIC52_4: IC52.4(RS+) R509.2 RS51.1
NetIC52_5: IC52.5(RS-) RS51.2 ; port SIGNAL
NetR505_2: R505.2 R506.1 U51.4(-IN)
NetR506_2: R506.2 R509.1 U51.1(VOUT)

Not connected (* = marked no-connect by the designer): Y51 1(STANDBY#)*

### Notes on the sheet
- [5] 5_EIT_Wave Generator
- Low Power, 12.65 mW, 2.3 V to 5.5 V, Programmable Waveform Generator. DC-12.5MHz
- (near RS51) Shunt resistor
- 400 MHz Low Power High Performance Amplifier. By adding the gain, the higher input is provided.
  A=1+R24/R14=7
- (near R503) The output frequency can be adjusted to the required frequency in the range of DC to 12.5 MHz by software.
- 7 Low, 1 High Order Band Pass Butterworth
  Lower Corner Frequency = 1.000 KHz
  Upper Corner Frequency = 12.00 MHz
- (near Y51) PURE SILICON™ CLOCK OSCILLATORS.       25MHz
- (near IC52) OUT-ADC-->  should be connected to the ADC
- Wave Generator
- 5
- 8
- Narges and Pedro

### Library data of the parts
C501-C514 = Capacitor: Device Class L1: Passive Components; Device Class L2: Capacitors
IC51 = AD9833WBRMZ-REEL: Integrated Circuit; Manufacturer_Name: Analog Devices; Datasheet Link: https://componentsearchengine.com/Datasheets/1/AD9833WBRMZ-REEL.pdf; Height: 1.1mm; Manufacturer_Part_Number: AD9833WBRMZ-REEL; Mouser Part Number: 584-AD9833WBRMZ-REEL; Mouser Price/Stock: https://www.mouser.co.uk/ProductDetail/Analog-Devices/AD9833WBRMZ-REEL?qs=pqQDoYZ2quYFMaVwD82%2FEg%3D%3D; Arrow Part Number: AD9833WBRMZ-REEL; Arrow Price/Stock: https://www.arrow.com/en/products/ad9833wbrmz-reel/analog-devices?region=nac
IC52 = MAX4376TAUK+T: MAX4376 Series 28 V 2MHz Buffer Current Sense Operational Amplifier - SOT-23-5; Manufacturer_Name: Analog Devices; Manufacturer: Maxim; Min Supply Voltage: 3V; Max Supply Voltage: 28V; Slew Rate: 10V/µs; Common Mode Rejection Ratio: 90dB; Operating Supply Current: 1mA; Output Current per Channel: 2mA; Number of Circuits: 1; Input Bias Current: 800uA; Bandwidth: 1.7MHz; Max Supply Current: 2.2mA; Datasheet Link: https://pdfserv.maximintegrated.com/en/ds/MAX4376-MAX4378.pdf; Height: 1.45mm; Manufacturer_Part_Number: MAX4376TAUK+T; Mouser Part Number: 700-MAX4376TAUK+T; Mouser Price/Stock: https://www.mouser.co.uk/ProductDetail/Maxim-Integrated/MAX4376TAUK%2bT?qs=1eQvB6Dk1viezN1idOFyfw%3D%3D; Supplier: Mouser; Supplier Part Number: 700-MAX4376TAUK+T; Manufacturer Part Number: MAX4376TAUK+T; RoHS: Yes; Category: Amplifiers - Op Amps, Buffer, Instrumentation; Stock: 10809; Pricing: 1=2,84, 10=2,55, 50=2,41, 100=2,09, 1000=1,61, 10000=1,55 (USD); Case/Package: SOT-23-5; Pins: 5; Weight: 0.001058oz; Min Operating Temperature: -40°C; Max Operating Temperature: 125°C; Packaging: Tape and Reel; -3db Bandwidth: 2MHz; Package Quantity: 2500; Number of Amplifiers: 1; Series: MAX4376T; Length: 3mm; Width: 1.75mm; RoHS Compliant: Yes; Reach SVHC Compliant: Unknown; ComponentLink1URL: https://datasheet.ciiva.com/30481/0900766b8124c2e5-30481549.pdf?src-supplier=Rs; ComponentLink1Description: https://datasheet.ciiva.com/30481/0900766b8124c2e5-30481549.pdf?src-supplier=Rs; ComponentLink2URL: https://datasheet.ciiva.com/1802/max4376-max4378-1802098.pdf?src-supplier=Digi-Key; ComponentLink2Description: https://datasheet.ciiva.com/1802/max4376-max4378-1802098.pdf?src-supplier=Digi-Key; ComponentLink3URL: https://datasheet.ciiva.com/1802/max4376-max4378-1802099.pdf?src-supplier=Digi-Key; ComponentLink3Description: https://datasheet.ciiva.com/1802/max4376-max4378-1802099.pdf?src-supplier=Digi-Key; ComponentLink4URL: https://datasheet.ciiva.com/2976/max4376-max4378-2976259.pdf?src-supplier=Avnet; ComponentLink4Description: https://datasheet.ciiva.com/2976/max4376-max4378-2976259.pdf?src-supplier=Avnet; ComponentLink5URL: https://datasheet.ciiva.com/1802/max4376-max4378-1802100.pdf?src-supplier=Digi-Key; ComponentLink5Description: https://datasheet.ciiva.com/1802/max4376-max4378-1802100.pdf?src-supplier=Digi-Key; Supplier 1: Mouser; Supplier Part Number 1: 700-MAX4376TAUK+T
L501-L504 = 725321dda6339637d4d059423bc1c3c: as L301 on sheet 3_Phase_Amp; Radiation Hardening: No; Depth: 1mm; Case Code (Imperial): 0603; Inductance Tolerance: 2%; Series: LQW18A_00; Tolerance: 2%; Weight: 0.000106oz; Rated Current-Max: 650mA; Mount: Surface Mount; Series Resistance: 110mR; REACH SVHC: No SVHC; Current Rating: 650mA; Case Code (Metric): 1608; Lead Free: Lead Free; Resistor Type: Wirewound; Package Quantity: 4000; Termination: SMD/SMT; DC Current: 650mA; Height: 0.8mm; Min Operating Temperature: -55°C; Military Standard: Not; Max Operating Temperature: 125°C; Max DC Current: 650mA; Case/Package: 0603; Number of Pins: 2; Packaging: Tape and Reel; Width: 0.8mm; Length: 1.6mm
R501-R509 = RES-2: as R101 on sheet 1_RPi; Width: 0.8mm; Max Operating Temperature: 155degC; Tolerance: 5%; Package Reference: 0603; Height: 0.45mm; Depth: 0.8mm; Package Description: 2-Pin Surface Mount Device, Body 1.6 x 0.8 mm; Termination: SMD/SMT; Package Quantity: 5000; Case/Package: 0603; Case Code (Imperial): 0603; Radiation Hardening: No; Number of Pins: 2; Length: 1.6mm; Lead Free: LeadFree; Voltage Rating (DC): 50V; Military Standard: Not; Datasheet URL: http://www.yageo.com/NewPortal/yageodocoutput?fileName=/pdf/R-Chip/PYu-RC_Group_51_RoHS_L_5.pdf; Manufacturer URL: http://www.yageo.com/; Packaging: TapeandReel; Case Code (Metric): 1608; Min Operating Temperature: -55degC; Composition: ThickFilm; RoHSCompliant: true; Contact Plating: Tin; Datasheet Version: Rev. 5, 10/2016; REACH SVHC: NoSVHC
RS51 = CRM2512AFX-10R0ELF: Res Thick Film 2512 10 Ohm 1% 2W ±100ppm/°C Molded SMD SMD Paper T/R; Manufacturer_Name: Bourns; Datasheet Link: http://www.bourns.com/data/global/pdfs/CRM0805_1206_2010.pdf; Height: 0.8mm; Manufacturer_Part_Number: CRM2512AFX-10R0ELF; Mouser Part Number: 652-CRM2512AFX10R0LF; Mouser Price/Stock: https://www.mouser.co.uk/ProductDetail/Bourns/CRM2512AFX-10R0ELF?qs=wd5RIQLrsJh9GcgTtlCG0w%3D%3D; Arrow Part Number: CRM2512AFX-10R0ELF; Arrow Price/Stock: https://www.arrow.com/en/products/crm2512afx-10r0elf/bourns; Supplier: Farnell; Supplier Part Number: 2824741; Manufacturer: Bourns; Manufacturer Part Number: CRM2512AFX-10R0ELF; RoHS: No; Category: Chip SMD Resistors; Stock: 3780; Pricing: 10=0,395, 100=0,312, 500=0,244, 1000=0,209, 2000=0,202 (EUR); ComponentLink1URL: http://www.farnell.com/datasheets/2552937.pdf?src-supplier=Farnell; ComponentLink1Description: http://www.farnell.com/datasheets/2552937.pdf?src-supplier=Farnell; ComponentLink2URL: http://www.farnell.com/datasheets/2552937.pdf?src-supplier=Newark; ComponentLink2Description: http://www.farnell.com/datasheets/2552937.pdf?src-supplier=Newark; ComponentLink3URL: http://www.bourns.com/docs/product-datasheets/crm-a.pdf?src-supplier=Digi-Key; ComponentLink3Description: http://www.bourns.com/docs/product-datasheets/crm-a.pdf?src-supplier=Digi-Key; ComponentLink4URL: https://www.bourns.com/docs/product-datasheets/crm-a.pdf?src-supplier=Digi-Key; ComponentLink4Description: https://www.bourns.com/docs/product-datasheets/crm-a.pdf?src-supplier=Digi-Key; ComponentLink5URL: https://datasheet.octopart.com/CRM2512AFX-10R0ELF-Bourns-datasheet-99878395.pdf?src-supplier=Master+Electronics; ComponentLink5Description: https://datasheet.octopart.com/CRM2512AFX-10R0ELF-Bourns-datasheet-99878395.pdf?src-supplier=Master+Electronics; ComponentLink6URL: https://datasheet.ciiva.com/6550/crm-6550127.pdf?src-supplier=Digi-Key; ComponentLink6Description: https://datasheet.ciiva.com/6550/crm-6550127.pdf?src-supplier=Digi-Key; ComponentLink7URL: https://datasheet.ciiva.com/9122/crm-9122397.pdf?src-supplier=Avnet; ComponentLink7Description: https://datasheet.ciiva.com/9122/crm-9122397.pdf?src-supplier=Avnet; Supplier 1: Farnell; Supplier Part Number 1: 2824741
U51 = ADI-AD80XX-5: Single Channel Very Low Noise Operational Amplifier, 400 MHz BW, 4 KV/us SR, Industrial, 5-pin SOT23 (RJ-5), Reel; Manufacturer: Analog Devices; Generic Part Number: AD8014; PartNumber: AD8014ARTZ-REEL7; Amplifiers Per Package: 1; Input Bias Current: 5uA; V Span Min: 4.5V; Small Signal Bandwidth: 400MHz; V Span Max: 12V; Iq/Amp: 1.3mA; Slew Rate: 4KV/us; Input Offset Voltage: 2mV; DatasheetVersion: Rev. C; ComponentLink1Description: Manufacturer URL; PackageVersion: 121608-A; PackageReference: RJ-5; ComponentLink1URL: http://www.analog.com/en/index.html; PackageDescription: 5-Pin Small Outline Transistor Package, Body 2.9 x 1.6 mm, Pitch 0.95 mm; ComponentLink2Description: Datasheet; RevisionNote: Symbol corrected, Pin 2 orientation reversed; ComponentLink2URL: http://www.analog.com/static/imported-files/data_sheets/AD8014.pdf; Mounting Technology: Surface Mount; ComponentLink3Description: Package Specification; Code_JEDEC: MO-178-AA; ComponentLink3URL: http://www.analog.com/static/imported-files/packages/PKG_PDF/SOT-23(RJ)/RJ_5.pdf
Y51 = ASFLMB-25.000MHZ-XY-T: Crystal or Oscillator; Manufacturer_Name: ABRACON; Datasheet Link: https://abracon.com/Oscillators/ASFLMB.pdf; Height: 0.9mm; Manufacturer_Part_Number: ASFLMB-25.000MHZ-XY-T; Mouser Part Number: 815-ASFLMB-25-XY-T; Mouser Price/Stock: https://www.mouser.co.uk/ProductDetail/ABRACON/ASFLMB-25.000MHZ-XY-T?qs=CnD89xF1VSmONT2LProkzQ%3D%3D; Arrow Part Number: ASFLMB-25.000MHZ-XY-T; Arrow Price/Stock: https://www.arrow.com/en/products/asflmb-25.000mhz-xy-t/abracon

## Nets that join several sheets
3V3: 1_RPi (J11.17), 5_WG (C505.2 Y51.4)
GND: 1_RPi (19 pins), 2_ADC (37 pins), 3_Phase_Amp (13 pins), 5_WG (18 pins)
VDD: 2_ADC (6 pins), 3_Phase_Amp (L301.2), 5_WG (9 pins)
ADC_BUSY: 1_RPi (J11.15), 2_ADC (U21.14)
ADC_CONV: 1_RPi (J11.31), 2_ADC (U21.9 U21.10)
ADC_CS: 1_RPi (J11.24), 2_ADC (U21.13)
ADC_RESET: 1_RPi (J11.29), 2_ADC (U21.11)
ADC_SCLK: 1_RPi (J11.23), 2_ADC (U21.12)
ADC_V4: 1_RPi (P11.2), 2_ADC (U21.55)
ADC_V5: 1_RPi (P11.4), 2_ADC (U21.57)
ADC_V6: 1_RPi (P11.6), 2_ADC (U21.59)
ADC_V7: 1_RPi (P11.8), 2_ADC (U21.61)
ADC_V8: 1_RPi (P11.10), 2_ADC (U21.63)
CUR_SEN: 2_ADC (U21.53), 5_WG (IC52.1)
DOUTA: 1_RPi (J11.19), 2_ADC (U21.24)
DOUTB: 1_RPi (J11.21), 2_ADC (U21.25)
FSYNC: 1_RPi (J11.36), 5_WG (R501.1)
NetC310_2: 1_RPi (R103.2 R104.1), 3_Phase_Amp (C310.2 R306.1)
NetIC52_5: 1_RPi (R101.1), 5_WG (IC52.5 RS51.2)
SCLK: 1_RPi (J11.40), 5_WG (R502.1)
SDATA: 1_RPi (J11.38), 5_WG (R503.1)
V1: 2_ADC (U21.49), 3_Phase_Amp (C305.2 R303.2)
V2: 2_ADC (U21.51), 3_Phase_Amp (C308.2 R304.2)